# EAGLE design led driver schematic (EAGLE 9.6.0)

## Sheet 1 of 2
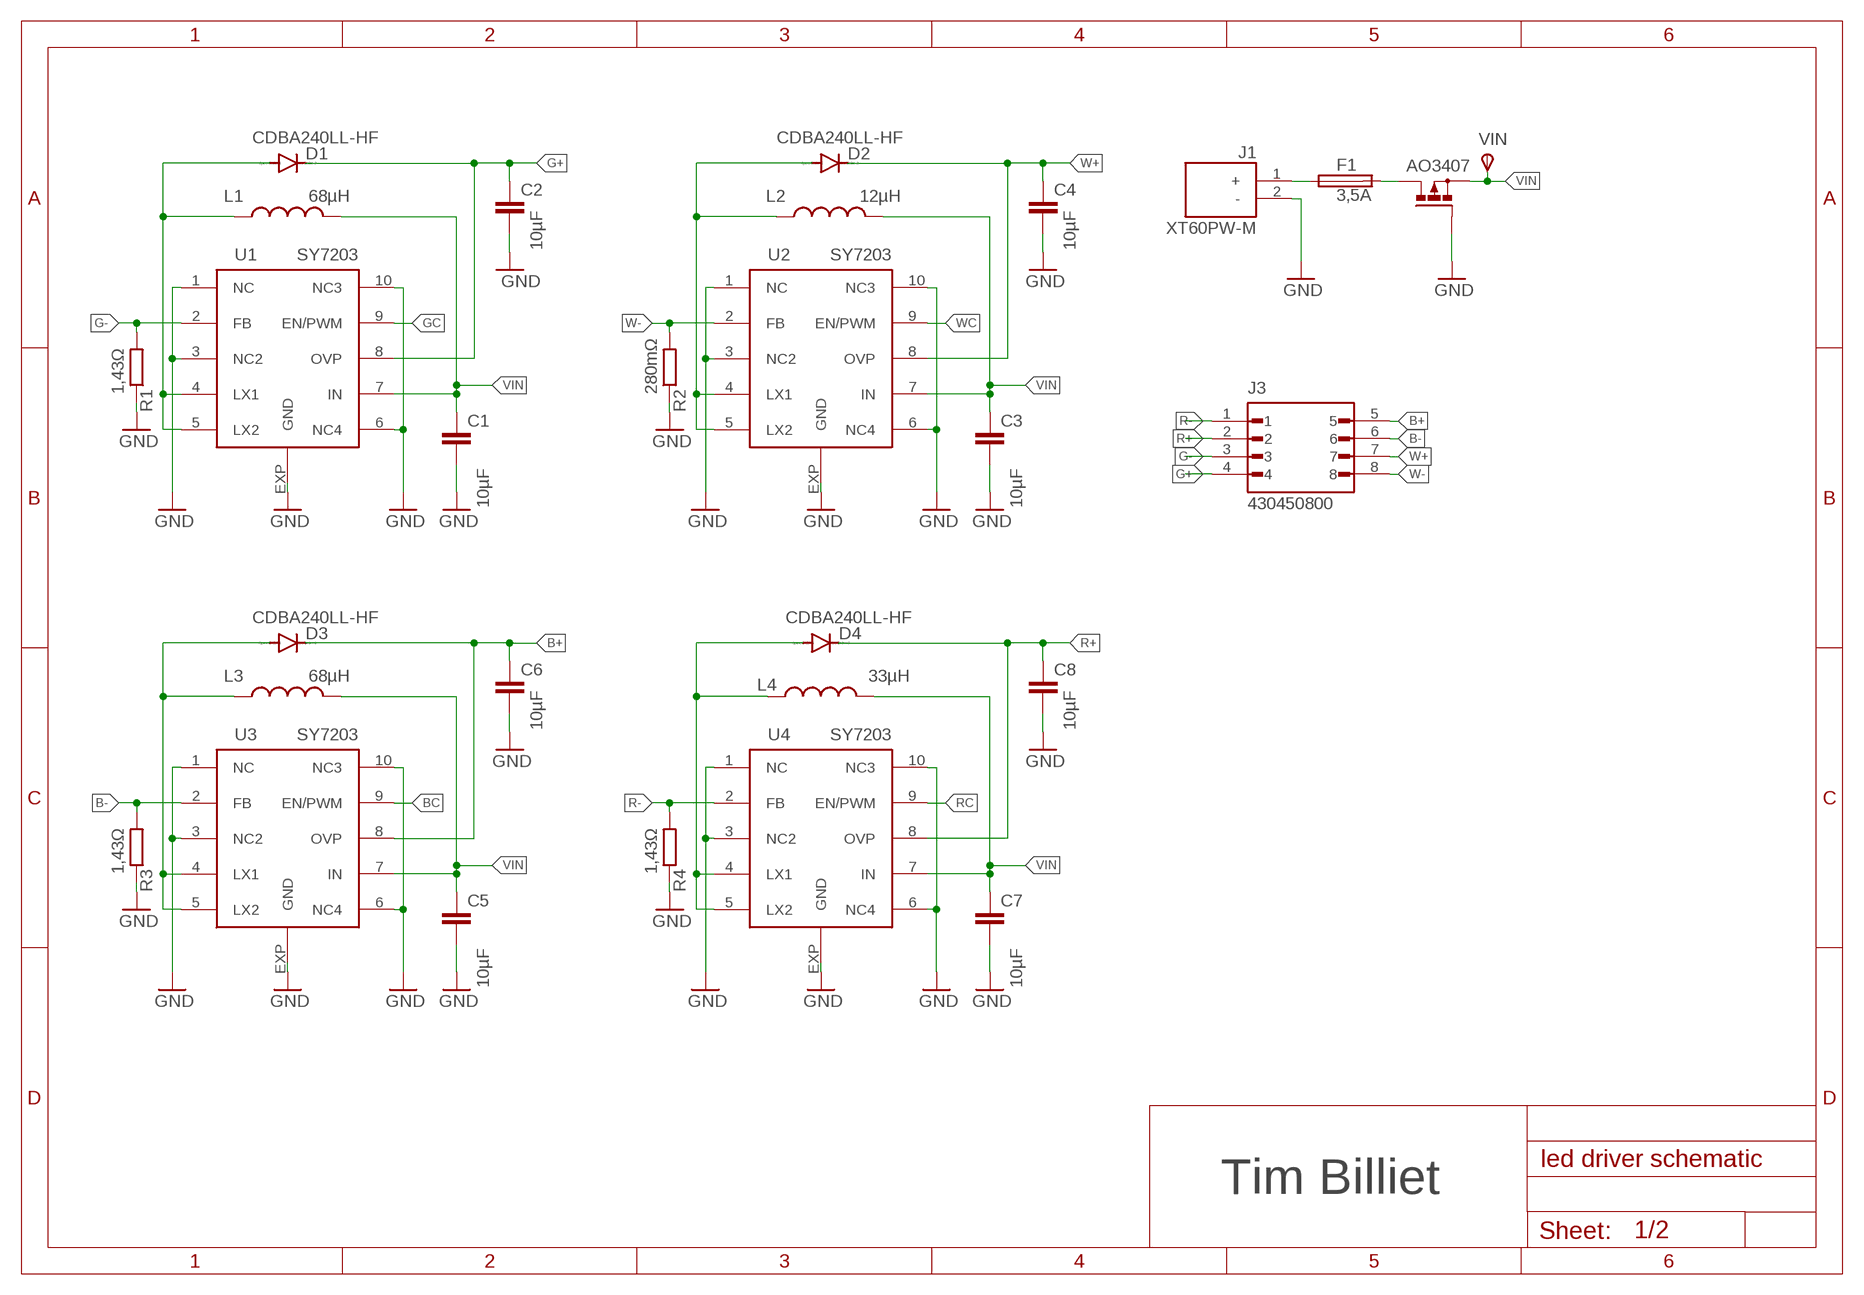
[diagram p0: schematic, sheet 1]

### Parts
C1  10µF  C-EUC0603  [C0603]
C2  10µF  C-EUC0603  [C0603]
C3  10µF  C-EUC0603  [C0603]
C4  10µF  C-EUC0603  [C0603]
C5  10µF  C-EUC0603  [C0603]
C6  10µF  C-EUC0603  [C0603]
C7  10µF  C-EUC0603  [C0603]
C8  10µF  C-EUC0603  [C0603]
D1  CDBA240LL-HF  DIODE-DO-214AC  [DO-214AC]
D2  CDBA240LL-HF  DIODE-DO-214AC  [DO-214AC]
D3  CDBA240LL-HF  DIODE-DO-214AC  [DO-214AC]
D4  CDBA240LL-HF  DIODE-DO-214AC  [DO-214AC]
F1  3,5A  0603FUSE0603  [R0603]
J1  XT60PW-M  [AMASS_XT60PW-M]
J3  430450800  [MOLEX_430450800]
L1  68µH  MBH125  [MBH125]
L2  12µH  MS127  [MS127-120MT]
L3  68µH  MBH125  [MBH125]
L4  33µH  MS127  [MS127-120MT]
Q1  AO3407  AO3407SOT23  [SOT23]
R1  1,43Ω  R-EU_R0805  [R0805]
R2  280mΩ  R-EU_R0805  [R0805]
R3  1,43Ω  R-EU_R0805  [R0805]
R4  1,43Ω  R-EU_R0805  [R0805]
U1  SY7203  SY7203DBC  [DFN10-3X3]
U2  SY7203  SY7203DBC  [DFN10-3X3]
U3  SY7203  SY7203DBC  [DFN10-3X3]
U4  SY7203  SY7203DBC  [DFN10-3X3]
VIN  TPSTP10R  [TP10R]

### Nets
B+: C6.1 D3.C J3.5 U3.8(OVP)
B-: J3.6 R3.2 U3.2(FB)
BC: U3.9(EN/PWM) ; also sheet 2
G+: C2.1 D1.C J3.4 U1.8(OVP)
G-: J3.3 R1.2 U1.2(FB)
GC: U1.9(EN/PWM) ; also sheet 2
GND: C1.2 C2.2 C3.2 C4.2 C5.2 C6.2 C7.2 C8.2 J1.2(-) Q1.1(G) R1.1 R2.1 R3.1 R4.1 U1.1(NC) U1.3(NC2) U1.6(NC4) U1.10(NC3) U1.EXP(GND) U2.1(NC) U2.3(NC2) U2.6(NC4) U2.10(NC3) U2.EXP(GND) U3.1(NC) U3.3(NC2) U3.6(NC4) U3.10(NC3) U3.EXP(GND) U4.1(NC) U4.3(NC2) U4.6(NC4) U4.10(NC3) U4.EXP(GND) ; also sheet 2
LX1: D1.A L1.P$1 U1.4(LX1) U1.5(LX2)
LX2: D2.A L2.P$1 U2.4(LX1) U2.5(LX2)
LX3: D3.A L3.P$1 U3.4(LX1) U3.5(LX2)
LX4: D4.A L4.P$1 U4.4(LX1) U4.5(LX2)
N$2: F1.1 J1.1(+)
N$27: F1.2 Q1.3(D)
R+: C8.1 D4.C J3.2 U4.8(OVP)
R-: J3.1 R4.2 U4.2(FB)
RC: U4.9(EN/PWM) ; also sheet 2
VIN: C1.1 C3.1 C5.1 C7.1 L1.P$2 L2.P$2 L3.P$2 L4.P$2 Q1.2(S) U1.7(IN) U2.7(IN) U3.7(IN) U4.7(IN) VIN.TP(PP) ; also sheet 2
W+: C4.1 D2.C J3.7 U2.8(OVP)
W-: J3.8 R2.2 U2.2(FB)
WC: U2.9(EN/PWM) ; also sheet 2

### Notes on the sheet
- Tim Billiet

## Sheet 2 of 2
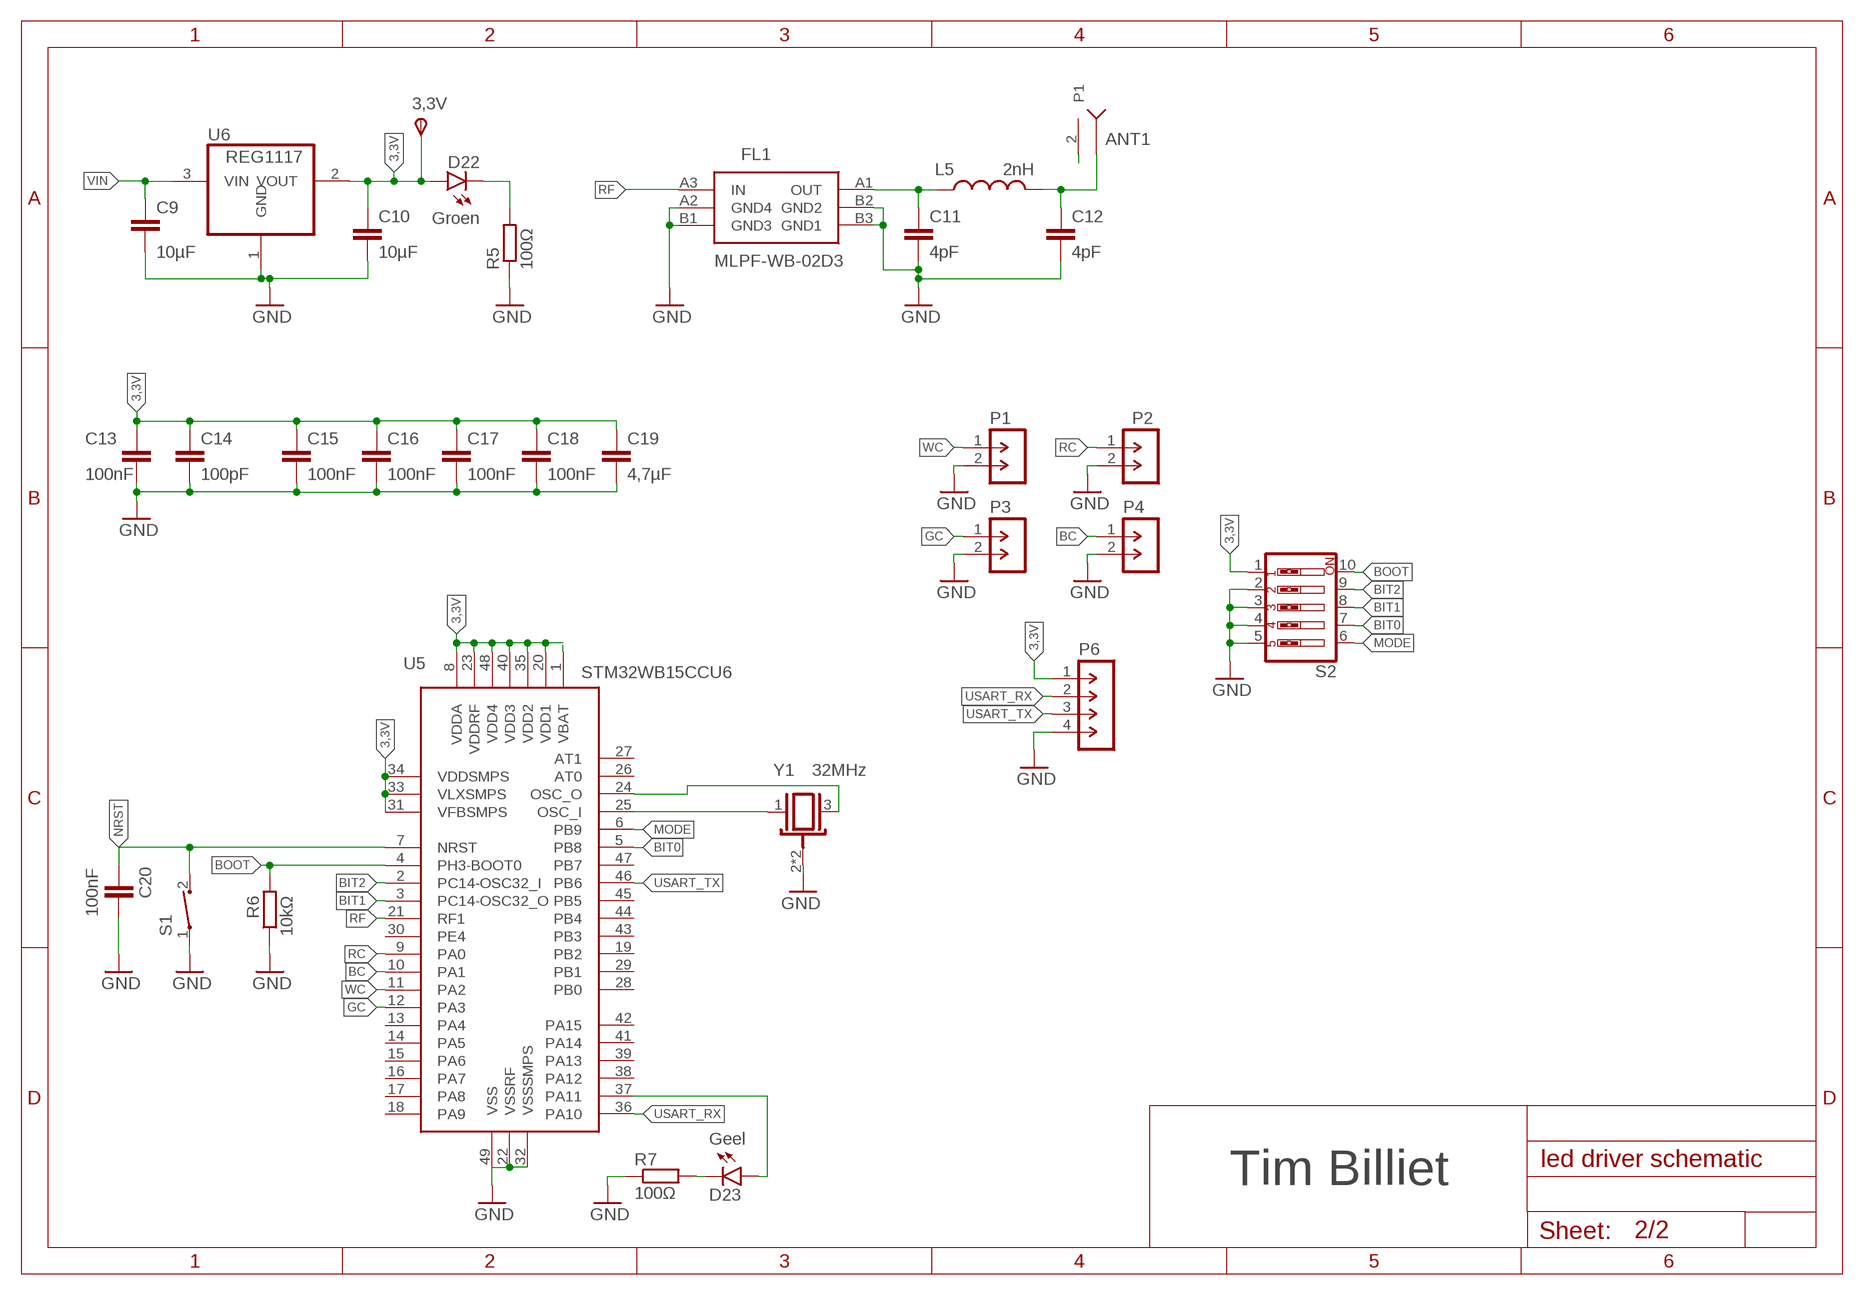
[diagram p1: schematic, sheet 2]

### Parts
3,3V  TPSTP10R  [TP10R]
ANT1  ANT3216LL00R2400A  [ANT3216LL00R2400A]
C9  10µF  C-EUC0603  [C0603]
C10  10µF  C-EUC0603  [C0603]
C11  4pF  C-EUC0603  [C0603]
C12  4pF  C-EUC0603  [C0603]
C13  100nF  C-EUC0603  [C0603]
C14  100pF  C-EUC0603  [C0603]
C15  100nF  C-EUC0603  [C0603]
C16  100nF  C-EUC0603  [C0603]
C17  100nF  C-EUC0603  [C0603]
C18  100nF  C-EUC0603  [C0603]
C19  4,7µF  C-EUC0603  [C0603]
C20  100nF  C-EUC0603  [C0603]
D22  Groen  LEDCHIP-LED0603  [CHIP-LED0603]
D23  Geel  LEDCHIP-LED0603  [CHIP-LED0603]
FL1  MLPF-WB-02D3  [MLPFWB02D3]
L5  2nH  0603INDUCTOR  [R0603]
P1  M-1X02-SIP-100-32  [SIP-100-02-32]
P2  M-1X02-SIP-100-32  [SIP-100-02-32]
P3  M-1X02-SIP-100-32  [SIP-100-02-32]
P4  M-1X02-SIP-100-32  [SIP-100-02-32]
P6  M-1X04-SIP-100-32  [SIP-100-04-32]
R5  100Ω  R-EU_R0603  [R0603]
R6  10kΩ  R-EU_R0603  [R0603]
R7  100Ω  R-EU_R0603  [R0603]
S1  TS-1088R-02026  [TS1088R02026]
S2  SW_DIP-5  [EDG-05]
U5  STM32WB15CCU6  [QFN50P700X700X60-49N]
U6  REG1117  [SOT223]
Y1  32MHz  NX2016SA  [OSC_NX2016SA]

### Nets
3,3V: 3,3V.TP(PP) C10.1 C13.1 C14.1 C15.1 C16.1 C17.1 C18.1 C19.1 D22.A P6.1 S2.1 U5.1(VBAT) U5.8(VDDA) U5.20(VDD1) U5.23(VDDRF) U5.31(VFBSMPS) U5.33(VLXSMPS) U5.34(VDDSMPS) U5.35(VDD2) U5.40(VDD3) U5.48(VDD4) U6.2(VOUT)
BC: P4.1 U5.10(PA1) ; also sheet 1
BIT0: S2.7 U5.5(PB8)
BIT1: S2.8 U5.3(PC14-OSC32_O)
BIT2: S2.9 U5.2(PC14-OSC32_I)
BOOT: R6.2 S2.10 U5.4(PH3-BOOT0)
GC: P3.1 U5.12(PA3) ; also sheet 1
GND: C9.2 C10.2 C11.2 C12.2 C13.2 C14.2 C15.2 C16.2 C17.2 C18.2 C19.2 C20.1 FL1.A2(GND4) FL1.B1(GND3) FL1.B2(GND2) FL1.B3(GND1) P1.2 P2.2 P3.2 P4.2 P6.4 R5.1 R6.1 R7.1 S1.1 S2.2 S2.3 S2.4 S2.5 U5.22(VSSRF) U5.32(VSSSMPS) U5.49(VSS) U6.1(GND) Y1.2(GND) Y1.4(GND) ; also sheet 1
MODE: S2.6 U5.6(PB9)
N$1: ANT1.1(ANTENNA) C12.1 L5.2
N$3: D23.A U5.37(PA11)
N$4: ANT1.2(P1)
N$11: C11.1 FL1.A1(OUT) L5.1
N$16: U5.25(OSC_I) Y1.1
N$17: U5.24(OSC_O) Y1.3
N$20: D22.C R5.2
N$23: D23.C R7.2
NRST: C20.2 S1.2 U5.7(NRST)
RC: P2.1 U5.9(PA0) ; also sheet 1
RF: FL1.A3(IN) U5.21(RF1)
USART_RX: P6.2 U5.36(PA10)
USART_TX: P6.3 U5.46(PB6)
VIN: C9.1 U6.3(VIN) ; also sheet 1
WC: P1.1 U5.11(PA2) ; also sheet 1
Unconnected: U5.13(PA4) U5.14(PA5) U5.15(PA6) U5.16(PA7) U5.17(PA8) U5.18(PA9) U5.19(PB2) U5.26(AT0) U5.27(AT1) U5.28(PB0) U5.29(PB1) U5.30(PE4) U5.38(PA12) U5.39(PA13) U5.41(PA14) U5.42(PA15) U5.43(PB3) U5.44(PB4) U5.45(PB5) U5.47(PB7)

### Notes on the sheet
- Tim Billiet

## Library data of the parts
3,3V VIN = testpad:TPS: TEST PIN
ANT1 = mijn-library:ANT3216LL00R2400A: Ceramic Chip Antenna ANT3216LL00R2400A 2.4 - 2.5 GHZ FEATURES z Compact size z Omni-directional radiation z Tape & reel automatic mounting z Reflow process compatible z RoHS compliant APPLICATIONS z 2.4 GHz WiFi device z Bluetooth gadget z Zigbee device z ISM band equipment
C1-C20 = rcl:C-EU: CAPACITOR, European symbol; SPICEPREFIX: C
D1-D4 = diode:DIODE-: DIODE
D22 D23 = led:LED: LED OSRAM: - CHIPLED LG R971, LG N971, LY N971, LG Q971, LY Q971, LO R971, LY R971 LH N974, LH R974 LS Q976, LO Q976, LY Q976 LO Q996 - Hyper CHIPLED LW Q18S LB Q993, LB Q99A, LB R99A - SideLED LS A670, LO A670, LY A670, LG A670, LP A670 LB A673, LV A673, LT A673, LW A673 LH A674 LY A675 LS A676, LA A676, LO A676, LY A676, LW A676 LS A679, LY A679, LG A679 - Hyper Micro SIDELED® LS Y876, LA Y876, LO Y876, LY Y876 LT Y87S - SmartLED LW L88C, LW L88S LB L89C, LB L89S, LG L890 LS L89K, LO L89K, LY L89K LS L896, LA L896, LO L896, LY L896 - TOPLED LS T670, LO T670, LY T670, LG T670, LP T670 LSG T670, LSP T670, LSY T670, LOP T670, LYG T670 LG T671, LOG T671, LSG T671 LB T673, LV T673, LT T673, LW T673 LH T674 LS T676, LA T676, LO T676, LY T676, LB T676, LH T676, LSB T676, LW T676 LB T67C, LV T67C, LT T67C, LS T67K, LO T67K, LY T67K, LW E67C LS E67B, LA E67B, LO E67B, LY E67B, LB E67C, LV E67C, LT E67C LW T67C LS T679, LY T679, LG T679 LS T770, LO T770, LY T770, LG T770, LP T770 LB T773, LV T773, LT T773, LW T773 LH T774 LS E675, LA E675, LY E675, LS T675 LS T776, LA T776, LO T776, LY T776, LB T776 LHGB T686 LT T68C, LB T68C - Hyper Mini TOPLED® LB M676 - Mini TOPLED Santana® LG M470 LS M47K, LO M47K, LY M47K Source: http://www.osram.convergy.de LUXEON: - LUMILED® LXK2-PW12-R00, LXK2-PW12-S00, LXK2-PW14-U00, LXK2-PW14-V00 LXK2-PM12-R00, LXK2-PM12-S00, LXK2-PM14-U00 LXK2-PE12-Q00, LXK2-PE12-R00, LXK2-PE12-S00, LXK2-PE14-T00, LXK2-PE14-U00 LXK2-PB12-K00, LXK2-PB12-L00, LXK2-PB12-M00, LXK2-PB14-N00, LXK2-PB14-P00, LXK2-PB14-Q00 LXK2-PR12-L00, LXK2-PR12-M00, LXK2-PR14-Q00, LXK2-PR14-R00 LXK2-PD12-Q00, LXK2-PD12-R00, LXK2-PD12-S00 LXK2-PH12-R00, LXK2-PH12-S00 LXK2-PL12-P00, LXK2-PL12-Q00, LXK2-PL12-R00 Source: www.luxeon.com KINGBRIGHT: KA-3528ASYC Source: www.kingbright.com
F1 = mijn-library:0603FUSE
FL1 = SamacSys_Parts:MLPF-WB-02D3: 2.4 GHz Low Pass Filter matched to STM32WB5x and STM32WB1x in WLCSP and UFBGA packages Source: Datasheet <https://www.st.com/resource/en/datasheet/mlpf-wb-02d3.pdf>; DESCRIPTION: 2.4 GHz Low Pass Filter matched to STM32WB5x and STM32WB1x in WLCSP and UFBGA packages; HEIGHT: 0.68mm; MANUFACTURER_NAME: STMicroelectronics; MANUFACTURER_PART_NUMBER: MLPF-WB-02D3; MOUSER_PART_NUMBER: 511-MLPF-WB-02D3; MOUSER_PRICE-STOCK: https://www.mouser.co.uk/ProductDetail/STMicroelectronics/MLPF-WB-02D3?qs=T%252BzbugeAwjhlflKeEN03Bg%3D%3D
J1 = XT60PW-M:XT60PW-M: Check availability <https://pricing.snapeda.com/parts/XT60PW-M/AMASS/view-part?ref=eda>; AVAILABILITY: Not in stock; CHECK_PRICES: https://www.snapeda.com/parts/XT60PW-M/AMASS/view-part/?ref=eda; DESCRIPTION: Socket, DC supply, male, PIN: 2; MF: AMASS; MP: XT60PW-M; PACKAGE: Package; PRICE: None; SNAPEDA_LINK: https://www.snapeda.com/parts/XT60PW-M/AMASS/view-part/?ref=snap
J3 = 430450800:430450800: Check availability <https://pricing.snapeda.com/parts/43045-0800/Molex/view-part?ref=eda>; AVAILABILITY: In Stock; CHECK_PRICES: https://www.snapeda.com/parts/43045-0800/Molex/view-part/?ref=eda; DESCRIPTION: Header 2 Row Right-Angle Snap-In Lock 8 Pin Tin Plate SMT/Glow Wire Compatible | Molex Incorporated 43045-0800; MF: Molex; MP: 43045-0800; PACKAGE: None; PRICE: None; PURCHASE-URL: https://www.snapeda.com/api/url_track_click_mouser/?unipart_id=313045&manufacturer=Molex&part_name=43045-0800&search_term=43045; SNAPEDA_LINK: https://www.snapeda.com/parts/43045-0800/Molex/view-part/?ref=snap
L1 L3 = mijn-library:MBH125
L2 L4 = mijn-library:MS127: ±20% SMD,12.2x12.2mm Power Inductors ROHS
L5 = mijn-library:0603INDUCTOR
P1-P4 = con-headers-jp:M-1X02-: MALE HEADER
P6 = con-headers-jp:M-1X04-: MALE HEADER
Q1 = mijn-library:AO3407
R1-R7 = rcl:R-EU_: RESISTOR, European symbol; SPICEPREFIX: R
S1 = SamacSys_Parts:TS-1088R-02026: SMD,3x4x2.0mm Tactile Switches Source: Datasheet <https://datasheet.lcsc.com/szlcsc/1912111437_XUNPU-TS-1088R-02026_C455280.pdf>; DESCRIPTION: SMD,3x4x2.0mm Tactile Switches; HEIGHT: 2.2mm; MANUFACTURER_NAME: XUNPU; MANUFACTURER_PART_NUMBER: TS-1088R-02026
S2 = special:SW_DIP-5: DIP SWITCH
U1-U4 = mijn-library:SY7203DBC: SY7203 develops a step-up DC/DC converter that delivers an accurate constant current for driving LEDs. Operating at a fixed switching frequency of 1MHz allows the device to be used with small value external ceramic capacitors and inductor. The LED current is programmable through the external resistor. The device also supports PWM dimming for accurate LED current control. SY7203 is ideal for driving up to eight white LEDs in series or up to 30V.
U5 = mijn-library:STM32WB15CCU6
U6 = burr-brown:REG1117: 800mA and 1A Low Dropout (LDO) Positive Regulator 1.8V, 2.5V, 2.85V, 3.3V, 5V, and Adj; MPN: REG1117
Y1 = NX2016SA-24MHZ-EXS00A-CS10820:NX2016SA: Crystal 6pF 80 Ohms 4-SMD, No Lead; AVAILABILITY: Not in stock; CHECK_PRICES: https://www.snapeda.com/parts/NX2016SA-24MHZ-EXS00A-CS10820/NDK+America%252C+Inc./view-part/?ref=eda; DESCRIPTION: 24 MHz ±15ppm Crystal 8pF 80 Ohms 4-SMD, No Lead; MF: NDK America, Inc.; MP: NX2016SA-24MHZ-EXS00A-CS10820; PACKAGE: SMD-4 NDK America,; PRICE: None; SNAPEDA_LINK: https://www.snapeda.com/parts/NX2016SA-24MHZ-EXS00A-CS10820/NDK+America%252C+Inc./view-part/?ref=snap

## Board
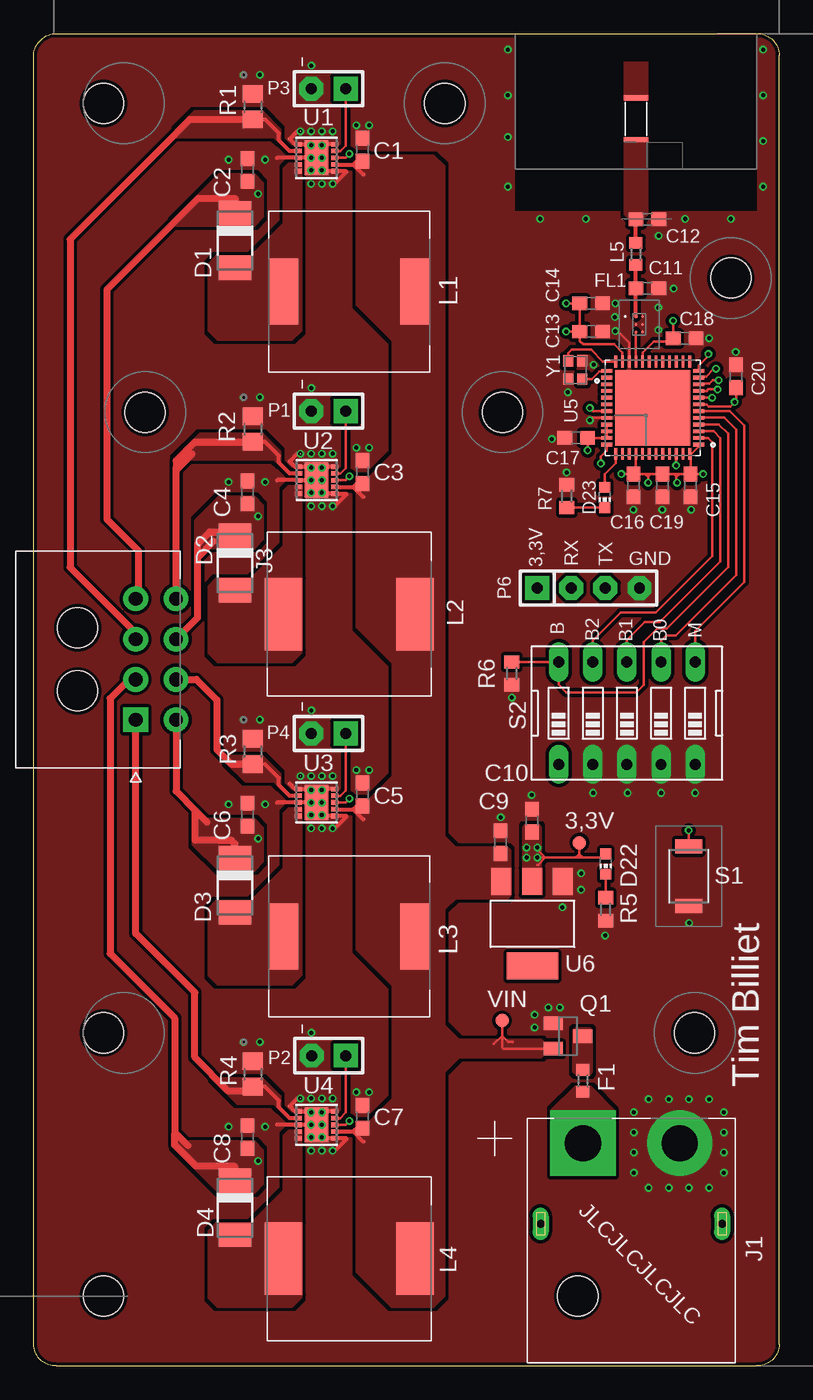
[diagram p2: board, top side]
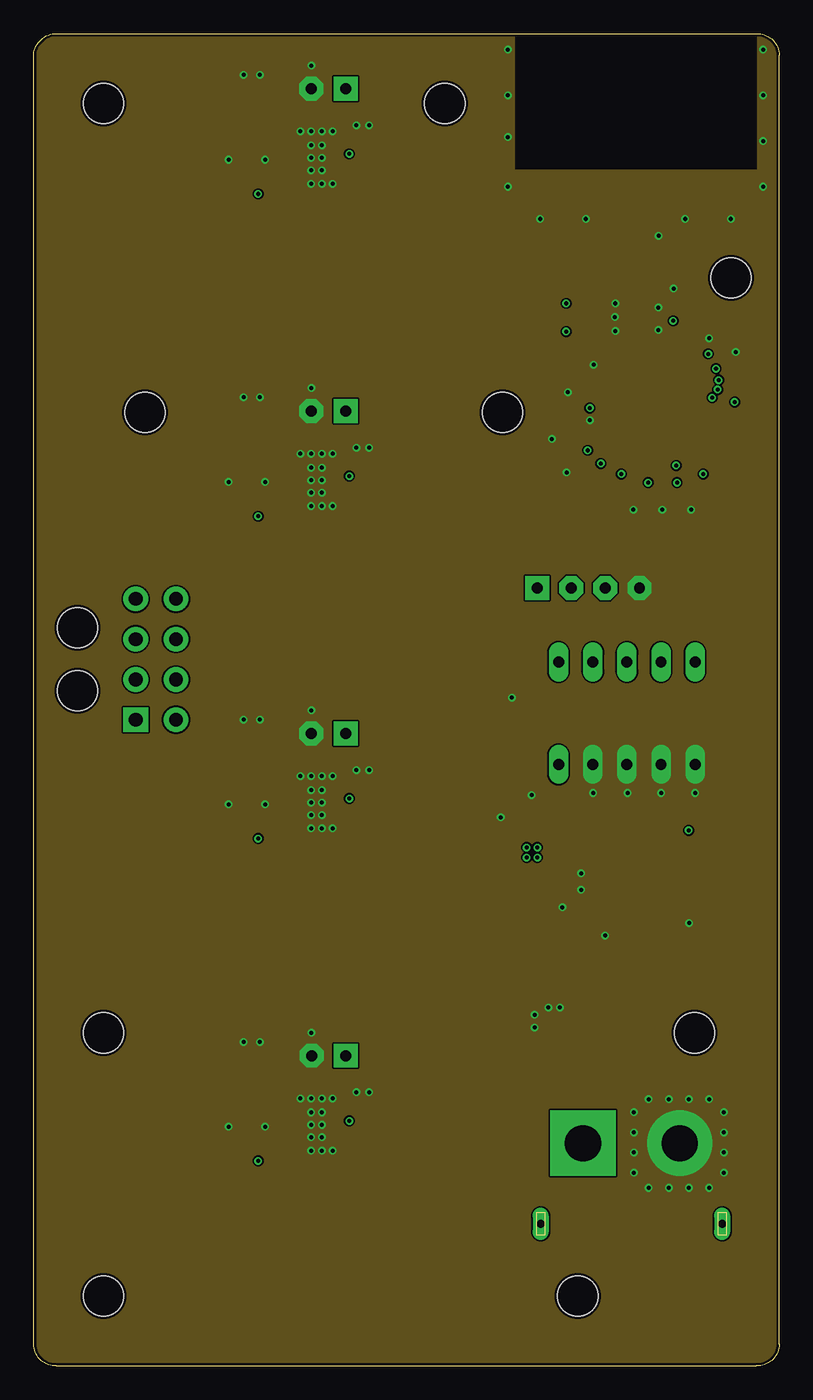
[diagram p3: board, inner layer Route2]
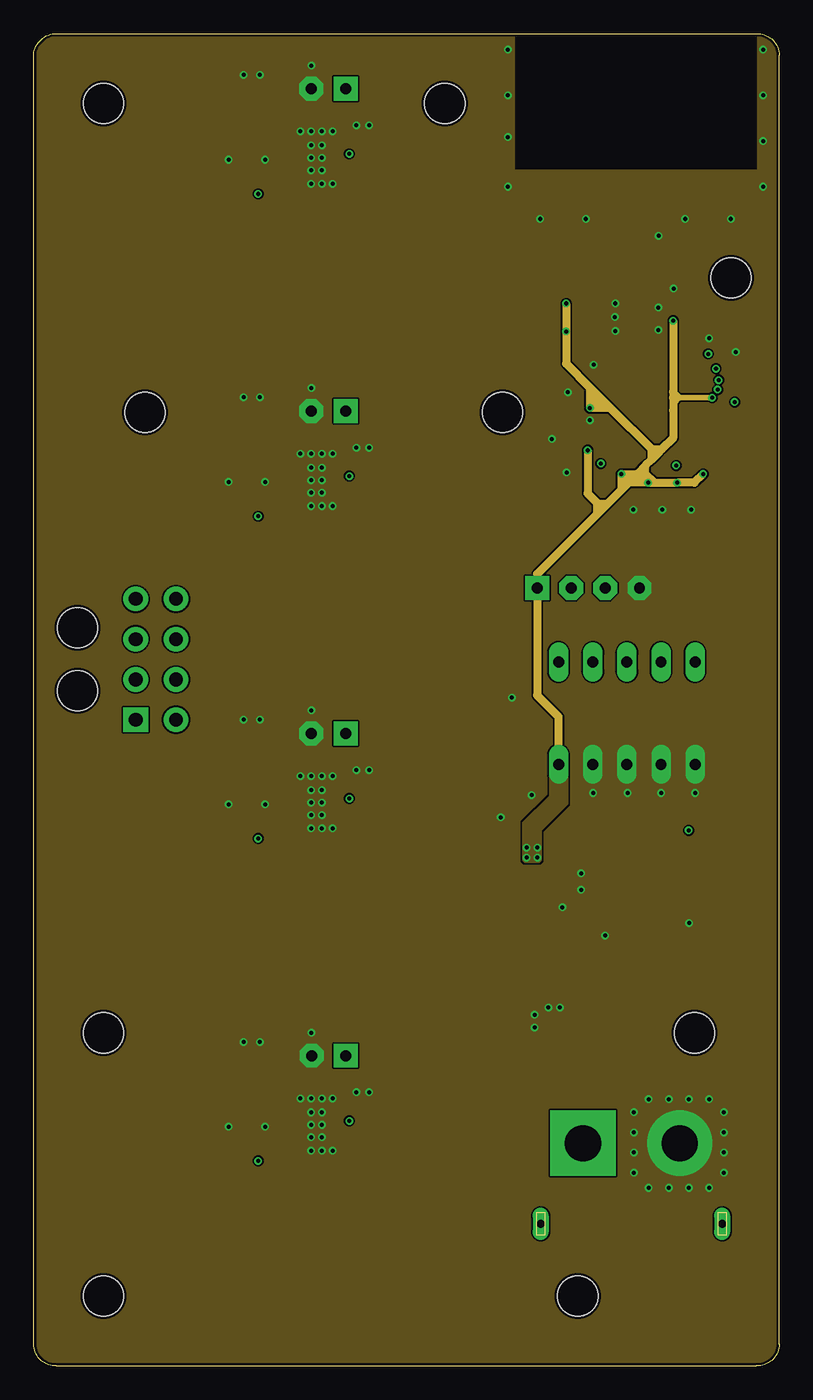
[diagram p4: board, inner layer Route15]
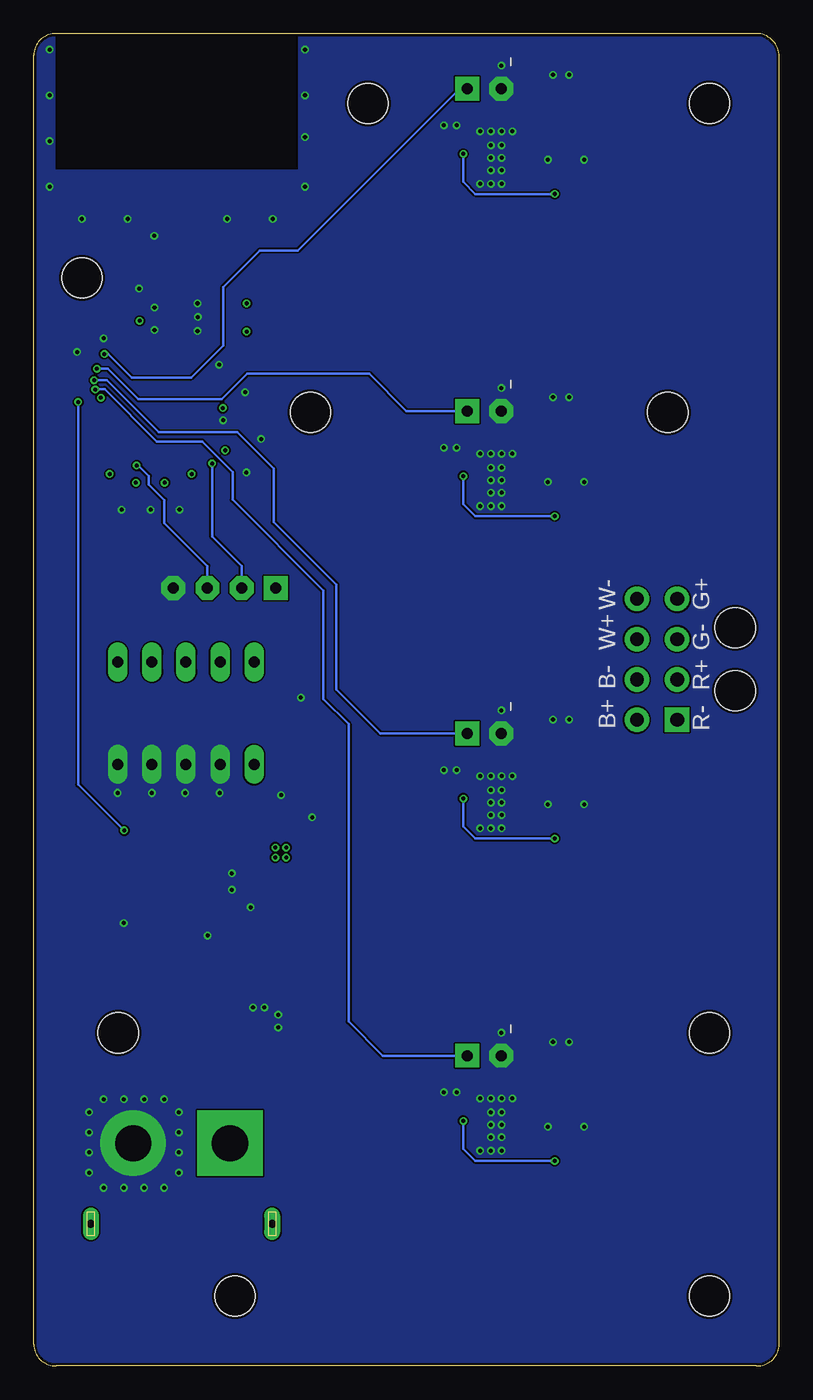
[diagram p5: board, bottom side, seen from below]

Size 55.5 x 99.2 mm. Coordinates in mm from the lower left corner, seen from the top.
Outline: 53.8,99.2 arc-90 55.5,97.6 55.5,1.6 arc-90 53.8,0 1.7,0 arc-90 0,1.6 0,97.5 arc-90 1.7,99.2 53.8,99.2
Copper layers (1+2*15+16): Top 0.035mm / dielectric 0.2mm / Route2 0.0175mm / dielectric 1.065mm / Route15 0.0175mm / dielectric 0.2mm / Bottom 0.035mm
Design rules "jlcpcb-4layers *": minimum track width 3.5mil, minimum drill 0.2mm, track to track 5mil, track to pad 0.2mm, pad to pad 5mil, via to via 5mil, smd to smd 5mil, copper to edge 0.2mm, drill to drill 6mil, minimum pad ring 10mil, minimum via ring 0.13mm, stop-mask expansion 0.05mm, vias tented up to drill 16mil, thermal gap 10mil
Holes 3 mm at 40.5,5.2 5.2,5.2 5.2,24.8 49.2,24.8 8.3,71 34.9,71 5.2,94 30.6,94 51.9,81

### Footprints (pad centres in the part's own frame; a part is rotated, then mirrored left to right if it is on the bottom)
TP10R = smd 1 x 1: TP 0,0
ANT3216LL00R2400A = smd 0.4 x 1.8: 1 1.55,0; 2 -1.55,0
C0603 = smd 1.1 x 1: 1 -0.85,0; 2 0.85,0
DO-214AC = smd 1.8 x 2.4: A 2.025,0; C -2.025,0
CHIP-LED0603 = smd 0.8 x 0.8: A 0,-0.75; C 0,0.75
R0603 = smd 0.87 x 0.98: 1 -0.815,0; 2 0.815,0
MLPFWB02D3 = smd 0.22 x 0.22: A1 -0.25,0.577; A2 -0.25,0; A3 -0.25,-0.577; B1 0.25,0.577; B2 0.25,0; B3 0.25,-0.577
AMASS_XT60PW-M = drill 2.7 square: 1 3.6,-6 | drill 2.7: 2 -3.6,-6 | drill 0.6 pad 1.2 long: S1 6.75,0; S2 -6.75,0
MOLEX_430450800 = drill 1.02 pad 1.52 square: 1 0,0 | drill 1.02 pad 1.52: 2 -3,0; 3 -6,0; 4 -9,0; 5 0,3; 6 -3,3; 7 -6,3; 8 -9,3 | hole 3: -2.15,-4.32; -6.85,-4.32
MBH125 = smd 4.9 x 2.2: P$1 0,4.9; P$2 0,-4.9
MS127-120MT = smd 5.4 x 2.8: P$1 0,-4.9; P$2 0,4.9
SIP-100-02-32 = drill 0.813 pad 1.778 square: 1 -1.27,0 | drill 0.813 pad 1.778 octagon: 2 1.27,0
SIP-100-04-32 = drill 0.813 pad 1.778 square: 1 -3.81,0 | drill 0.813 pad 1.778 octagon: 2 -1.27,0; 3 1.27,0; 4 3.81,0
SOT23 = smd 1 x 1.4: 1 -0.95,-1.1; 2 0.95,-1.1; 3 0,1.1
R0805 = smd 1.3 x 1.5: 1 -0.95,0; 2 0.95,0
R0603' = smd 1 x 1.1: 1 -0.85,0; 2 0.85,0
TS1088R02026 = smd 1.05 x 2: 1 -2.225,0; 2 2.225,0
EDG-05 = drill 0.813 long: 1 -5.08,-3.81; 2 -2.54,-3.81; 3 0,-3.81; 4 2.54,-3.81; 5 5.08,-3.81; 6 5.08,3.81; 7 2.54,3.81; 8 0,3.81; 9 -2.54,3.81; 10 -5.08,3.81
DFN10-3X3 = smd 0.3 x 0.55: 1 -1,-1.35; 2 -0.5,-1.35; 3 0,-1.35; 4 0.5,-1.35; 5 1,-1.35; 6 1,1.35; 7 0.5,1.35; 8 0,1.35; 9 -0.5,1.35; 10 -1,1.35 | smd 2.6 x 1.75: EXP 0,0
QFN50P700X700X60-49N = smd 0.87 x 0.27: 1 -3.43,2.75; 2 -3.43,2.25; 3 -3.43,1.75; 4 -3.43,1.25; 5 -3.43,0.75; 6 -3.43,0.25; 7 -3.43,-0.25; 8 -3.43,-0.75; 9 -3.43,-1.25; 10 -3.43,-1.75; 11 -3.43,-2.25; 12 -3.43,-2.75; 25 3.43,-2.75; 26 3.43,-2.25; 27 3.43,-1.75; 28 3.43,-1.25; 29 3.43,-0.75; 30 3.43,-0.25; 31 3.43,0.25; 32 3.43,0.75; 33 3.43,1.25; 34 3.43,1.75; 35 3.43,2.25; 36 3.43,2.75 | smd 0.27 x 0.87: 13 -2.75,-3.43; 14 -2.25,-3.43; 15 -1.75,-3.43; 16 -1.25,-3.43; 17 -0.75,-3.43; 18 -0.25,-3.43; 19 0.25,-3.43; 20 0.75,-3.43; 21 1.25,-3.43; 22 1.75,-3.43; 23 2.25,-3.43; 24 2.75,-3.43; 37 2.75,3.43; 38 2.25,3.43; 39 1.75,3.43; 40 1.25,3.43; 41 0.75,3.43; 42 0.25,3.43; 43 -0.25,3.43; 44 -0.75,3.43; 45 -1.25,3.43; 46 -1.75,3.43; 47 -2.25,3.43; 48 -2.75,3.43 | smd 5.6 x 5.6: 49 0,0
SOT223 = smd 1.499 x 2.007: 1 -2.261,-3.15; 2 0.025,-3.15; 3 2.311,-3.15 | smd 3.81 x 2.007: 4 0,3.15
OSC_NX2016SA = smd 0.75 x 0.85: 1 -0.525,0.675; 2 -0.525,-0.675; 3 0.525,-0.675; 4 0.525,0.675

### Placement (x,y rotation side)
3,3V  40.62,38.94 0 top
ANT1  44.83,92.85 270 top
C1  24.48,90.55 90 top
C2  15.92,89.04 90 top
C3  24.48,66.55 90 top
C4  15.92,65.04 90 top
C5  24.48,42.55 90 top
C6  15.92,41.04 90 top
C7  24.48,18.55 90 top
C8  15.92,17.04 90 top
C9  34.76,39 90 top
C10  37.11,40.6 90 top
C11  45.68,80.22 0 top
C12  45.68,85.37 0 top
C13  41.49,77.01 0 top
C14  41.49,79.11 0 top
C15  48.9,65.56 270 top
C16  44.65,65.56 270 top
C17  40.38,69.1 180 top
C18  48.45,76.5 0 top
C19  46.8,65.56 270 top
C20  52.28,73.69 270 top
D1  14.99,83.78 270 top
D2  14.99,59.78 270 top
D3  14.99,35.78 270 top
D4  14.99,11.78 270 top
D22  42.58,37.37 180 top
D23  42.51,64.66 180 top
F1  40.88,21.23 90 top
FL1  45.08,77.56 0 top
J1  44.49,10.58 180 top
J3  7.6,48.11 270 top
L1  23.5,79.98 90 top
L2  23.5,55.98 270 top
L3  23.5,31.98 90 top
L4  23.5,7.98 270 top
L5  44.83,82.79 90 top
P1  21.95,71.1 180 top
P2  21.96,23.1 180 top
P3  21.95,95.1 180 top
P4  21.95,47.1 180 top
P6  41.29,57.93 0 top
Q1  39.77,24.56 270 top
R1  16.32,93.74 270 top
R2  16.32,69.74 270 top
R3  16.31,45.74 270 top
R4  16.32,21.74 270 top
R5  100Ω  [R0603']  42.58,34 90 top
R6  10kΩ  [R0603']  35.59,51.56 90 top
R7  100Ω  [R0603']  39.68,64.76 270 top
S1  48.76,36.46 90 top
S2  44.16,48.6 0 top
U1  21.06,89.95 270 top
U2  21.07,65.95 270 top
U3  21.06,41.95 270 top
U4  21.06,17.95 270 top
U5  46.08,71.34 180 top
U6  37.13,32.92 180 top
VIN  34.87,25.71 0 top
Y1  40.32,74.15 180 top

### Tracks (layer width: path | path; a pad name or v marks a point on that pad's centre or on a via)
3,3V  (via drill 0.3)
  Top 0.203: C13.1 C14.1 | C14.1 | C13.1 40.65,76.31 40.9,76.06 43.2,76.06 43.83,75.43 U5.23 | C17.1 U5.35 U5.34 U5.33 | C17.1 | U5.40 44.83,66.59 C16.1 | C16.1 45.54,66.41 | 45.54,66.41 45.75,66.41 | 45.75,66.41 45.95,66.41 | 45.95,66.41 C19.1 47.65,66.41 | U5.48 48.9,67.84 | 48.9,67.84 C15.1 | C15.1 48.05,66.41 | 48.05,66.41 47.85,66.41 | 47.85,66.41 47.65,66.41 | U5.20 45.33,75.44 46.14,76.25 47.38,76.25 C18.1 v47.6,77.81 | v39.64,77.01 C13.1 | v39.64,79.11 C14.1 | v41.24,68.17 C17.1 | v43.74,66.41 C16.1 | v47.89,65.76 47.85,65.8 47.85,66.21 | 47.85,66.41 47.85,66.21 | 47.65,66.41 47.85,66.21 | 47.85,66.21 48.05,66.41 | v45.74,65.76 45.74,66.21 | 45.74,66.21 45.74,66.4 45.75,66.41 | 45.95,66.41 45.75,66.21 45.74,66.21 | 45.54,66.41 45.74,66.21 | v49.84,66.41 C15.1 | C10.1 37.11,39.71 | v50.5,72.08 U5.8 | U5.31 41.63,71.1 v41.41,71.32 | U5.1 49.51,68.45 48.9,67.84 | D22.A 42.31,37.85 40.87,37.85 | 40.87,37.85 40.61,37.85 | 40.61,37.85 40.37,37.85 | 40.37,37.85 38.09,37.85 | v37.5,37.85 38.09,37.85 | 40.61,37.85 40.62,37.86 40.62,38.1 | 3,3V.TP 40.62,38.1 | 40.37,37.85 40.62,38.1 | 40.62,38.1 40.87,37.85 | 38.09,37.85 37.5,38.44 v37.5,38.6 | 38.09,37.85 37.55,37.31 37.49,37.31
  Route15 0.41: 47.6,72.07 47.61,72.08 48.06,72.08 | v50.5,72.08 48.06,72.08 | 47.6,72.54 48.06,72.08 | 48.06,72.08 47.6,71.62 47.6,71.14
  Route15 0.6: S2.1 39.08,48.33 37.48,49.93 P6.1 37.48,58.96 41.95,63.43 | v49.84,66.41 49.19,65.76 v47.89,65.76 46.19,65.76 | v45.74,65.76 46.19,65.76 | 46.77,68.25 47.6,69.08 47.6,71.14 47.6,72.07 47.6,72.54 v47.6,77.81 | 46.77,68.25 46.38,67.86 | 46.38,67.86 46,67.48 | 46,67.48 45.54,67.02 | 45.54,67.02 45.01,66.49 | 44.93,66.41 44.7,66.18 | 44.7,66.18 44.34,65.81 | 44.34,65.81 43.74,65.22 | 43.74,65.22 42.74,64.22 | 42.74,64.22 42.36,63.84 | 42.36,63.84 41.95,63.43 | v45.74,65.76 45.32,66.18 | 45.32,66.18 45.01,66.49 | 46.19,65.76 45.54,66.41 45.54,67.02 | 45.32,66.18 44.7,66.18 | 44.34,65.81 v43.74,66.41 | v43.74,66.41 43.74,65.7 | 43.74,65.7 43.74,65.22 | v43.74,66.41 44.93,66.41 | 44.93,66.41 45.01,66.49 | v45.74,65.76 43.8,65.76 43.74,65.7 | v39.64,79.11 v39.64,77.01 39.64,74.61 41.41,72.84 | 41.41,72.84 41.41,72.01 | 42.93,71.32 46,68.25 | 46,68.25 46.38,67.86 | 41.41,72.01 42.1,71.32 | 42.93,71.32 42.1,71.32 | 42.1,71.32 v41.41,71.32 41.41,72.01 | 41.41,72.84 42.93,71.32 | v41.24,68.17 41.24,64.96 41.95,64.25 | 41.95,64.25 41.99,64.21 | 41.99,64.21 42.36,63.84 | 41.95,63.43 41.95,64.25 | 41.99,64.21 42.01,64.22 42.74,64.22 | 46,67.48 46,68.25 | 46,68.25 46.77,68.25
  other vias: 36.7,37.85 36.7,38.6
  pour Top (no thermals): 36.41,36.93 36.41,40.11 36.56,40.26 37.65,40.26 37.8,40.11 37.8,36.93
  pour Route15 (no thermals): 36.41,40.42 36.41,37.68 36.59,37.5 37.61,37.5 37.79,37.68 37.79,39.92 39.76,41.89 39.76,45.07 39.41,45.42 38.75,45.42 38.4,45.07 38.4,42.41
B+  (via drill 0.3)
  Top 0.203: v23.51,42.24 23.22,41.95 U3.8
  Top 0.508: 14.42,37.8 D3.C 14.99,38.88 14.73,39.14 12.03,39.14 12.02,39.15 12.02,41.35 12.05,41.35 | 12.05,41.35 12.7,40.7 12.9,40.5 | J3.5 10.6,42.8 12.05,41.35
  Bottom 0.203: v23.51,42.24 23.51,40.16 22.61,39.26 v16.71,39.26
  pour Top (no thermals): 16.41,36.86 13.8,36.86 11.81,38.84 11.81,40.76 16.41,40.76 17.11,40.06 17.11,37.56
B-
  Top 0.3: U3.2 19.06,42.45 18.25,43.26 18.25,43.77 17.23,44.79
  Top 0.508: R3.2 14.74,44.79 13.64,45.89 13.64,49.59 12.12,51.11 J3.6
  pour Top (no thermals): 17.01,45.46 17.01,43.86 16.61,43.46 15.78,43.46 14.3,44.94 14.3,45.46
  pour Top (no thermals): 18.31,43.06 17.91,43.46 16.51,43.46 16.51,44.96 17.01,45.46 18.41,44.06 18.41,43.06
BC  (via drill 0.3)
  Top 0.203: P4.1 23.23,42.86 22.82,42.45 U3.9 | U5.10 49.57,73.15 50.3,73.15 50.54,73.39 v50.99,73.39
  Bottom 0.203: v50.99,73.39 50.07,73.39 46.2,69.52 40.33,69.52 37.63,66.82 37.63,62.82 32.97,58.16 32.97,50.38 29.69,47.1 P4.1
BIT0
  Top 0.203: U5.5 51.41,70.59 52.3,69.7 52.3,58.9 47.8,54.4 47.1,54.4 46.7,54 S2.7
BIT1
  Top 0.203: S2.8 44.16,54.06 45.5,55.4 46.6,55.4 51.1,59.9 51.1,69.1 50.61,69.59 U5.3
BIT2
  Top 0.203: S2.9 41.62,54.02 43.7,56.1 46.3,56.1 50.5,60.3 50.5,68.8 50.2,69.1 U5.2
BOOT
  Top 0.203: R6.2 S2.10 39.08,50.72 39.65,50.15 44.85,50.15 45.4,50.7 45.4,53.9 46.4,54.9 47.13,54.9 51.7,59.47 51.7,69.4 51.01,70.09 U5.4
G+  (via drill 0.3)
  Top 0.203: v23.51,90.24 23.22,89.95 U1.8
  Top 0.508: D1.C 15,86.94 12.27,86.94 5.46,80.13 5.46,63.04 7.8,60.7 7.8,57.31 J3.4
  Bottom 0.203: v23.51,90.24 23.51,88.16 22.61,87.26 v16.71,87.26
  pour Top (no thermals): 16.41,84.86 10.27,84.86 10.27,85.22 13.8,88.76 16.41,88.76 17.11,88.06 17.11,85.56
G-
  Top 0.3: U1.2 19.06,90.45 18.25,91.26 18.25,91.77 17.23,92.79 R1.2
  Top 0.508: R1.2 11.62,92.79 2.71,83.88 2.71,59.46 7.6,54.57 J3.3
  pour Top (no thermals): 17.01,93.46 17.01,91.86 16.61,91.46 10.56,91.46 10.56,92.02 12,93.46
  pour Top (no thermals): 18.31,91.06 17.91,91.46 16.51,91.46 16.51,92.96 17.01,93.46 18.41,92.06 18.41,91.06
GC  (via drill 0.3)
  Top 0.203: P3.1 23.23,90.86 22.82,90.45 U1.9 | v50.23,75.35 50.23,75.2 49.51,74.48 U5.12
  Bottom 0.203: v50.23,75.35 49.95,75.35 48.2,73.6 43.77,73.6 41.39,75.98 41.39,80.31 38.65,83.05 35.85,83.05 23.8,95.1 P3.1
GND  (via drill 0.3)
  Top 0.203: C9.2 | 39.37,36.09 U6.1 39.41,36.05 | C10.2 | U5.22 44.33,76.18 43.29,77.22 | U5.32 41.59,70.59
  Top 0.3: U2.EXP 21.07,65.26 21.38,64.95 U2.6 23.25,64.95 23.3,64.9 22.42,64.02 22.34,64.02 | U2.EXP U2.3 18.12,65.95 | 20.95,66.95 U2.1 19.45,66.95 19.05,67.35 19.62,67.92 | 20.95,66.95 21.1,66.8 21.1,65.98 U2.EXP | U2.10 20.95,66.95 | U1.EXP 21.07,89.26 21.38,88.95 23.25,88.95 23.3,88.9 22.42,88.02 22.34,88.02 | U1.EXP 18.12,89.95 | 20.95,90.95 19.45,90.95 19.05,91.35 19.62,91.92 | 20.95,90.95 21.1,90.8 21.1,89.98 U1.EXP | U1.10 20.95,90.95 | U3.EXP 21.07,41.26 21.38,40.95 23.25,40.95 23.3,40.9 22.42,40.02 v22.26,40.02 | U3.EXP 18.12,41.95 | 20.95,42.95 19.45,42.95 19.05,43.35 | 20.95,42.95 21.1,42.8 21.1,41.98 U3.EXP | U3.10 20.95,42.95 | U4.EXP 21.07,17.26 21.38,16.95 23.25,16.95 23.3,16.9 22.42,16.02 22.34,16.02 | U4.EXP 18.12,17.95 | 20.95,18.95 19.45,18.95 19.05,19.35 19.62,19.92 | 20.95,18.95 21.1,18.8 21.1,17.98 U4.EXP | U4.10 20.95,18.95
  other vias: 14.52,65.81 17.23,65.81 15.64,72.12 16.84,72.12 24.02,68.37 24.97,68.37 20.68,72.81 51.37,17.39 51.37,14.39 51.37,15.89 51.37,18.89 47.28,19.86 50.28,19.86 48.78,19.86 45.78,19.86 37.29,25.19 37.29,26.14 39.17,26.69 38.32,26.69 44.64,63.75 46.79,63.75 48.94,63.75 38.57,69.01 43.3,77.06 43.3,79.11 50.28,76.52 34.77,40.85 37.07,42.5 40.75,35.45 40.75,36.67 42.54,32.05 14.52,89.81 17.23,89.81 15.64,96.12 16.84,96.12 24.02,92.37 24.97,92.37 20.68,96.81 14.52,41.81 17.23,41.81 19.86,43.92 20.66,43.92 21.46,43.92 22.26,43.92 21.46,40.02 20.66,40.02 15.64,48.12 16.84,48.12 24.02,44.37 24.97,44.37 20.68,48.81 14.52,17.81 17.23,17.81 15.64,24.12 16.84,24.12 24.02,20.37 24.97,20.37 20.68,24.81 41.69,74.55 39.76,72.49 41.4,70.42 52.26,75.5 48.79,32.98 39.67,66.52 35.6,49.76 43.27,78.1 46.5,77.13 46.5,78.81 46.52,84.14 54.3,87.8 47.64,80.22 49.24,42.66 46.7,42.66 44.22,42.66 41.65,42.66 47.28,13.26 50.28,13.26 48.78,13.26 45.78,13.26 44.68,17.39 44.68,14.39 44.68,15.89 44.68,18.89 54.3,94.6 54.3,98 54.3,91.2 35.3,98 35.3,94.6 35.3,91.5 35.3,87.8 37.7,85.4 41.1,85.4 48.5,85.4 51.9,85.4 39.35,34.15 21.46,42.88 20.66,42.88 21.46,41.02 20.66,41.02 21.46,41.95 20.66,41.95 22.26,16.02 19.86,19.92 20.66,19.92 21.46,19.92 22.26,19.92 21.46,16.02 20.66,16.02 21.46,18.88 20.66,18.88 21.46,17.02 20.66,17.02 21.46,17.95 20.66,17.95 22.26,88.02 19.86,91.92 20.66,91.92 21.46,91.92 22.26,91.92 21.46,88.02 20.66,88.02 21.46,90.88 20.66,90.88 21.46,89.02 20.66,89.02 21.46,89.95 20.66,89.95 22.26,64.02 19.86,67.92 20.66,67.92 21.46,67.92 22.26,67.92 21.46,64.02 20.66,64.02 21.46,66.88 20.66,66.88 21.46,65.02 20.66,65.02 21.46,65.95 20.66,65.95
  pour Route2 (no thermals): 0,99.2 55.5,99.2 55.5,0 0,0
  pour Top (isolate 0.254, rank 2, no thermals): 0,99.2 55.5,99.2 55.5,0 0,0
  pour Route15 (rank 2, no thermals): 0,99.2 55.5,99.2 55.5,0 0,0
  pour Bottom (no thermals): 0,99.2 55.5,99.2 55.5,0 0,0
  cutout Route2: 35.84,89.1 35.84,99.2 53.84,99.2 53.84,89.1
  cutout Route15: 35.84,89.1 35.84,99.2 53.84,99.2 53.84,89.1
  cutout Bottom: 35.84,89.1 35.84,99.2 53.84,99.2 53.84,89.1
  cutout Top: 35.84,86.03 43.79,86.03 43.79,98.21 45.86,98.21 45.86,86 53.84,86 53.84,99.2 35.84,99.2
LX1
  pour Top (no thermals): 19.95,89.55 19.95,77.1 19.23,76.38 13.7,76.38 12.99,77.09 12.99,82.04 13.6,82.65 16.19,82.65 18.59,85.05 18.59,89.14 19,89.55
LX2
  pour Top (no thermals): 19.95,65.55 19.95,53.1 19.23,52.38 13.7,52.38 12.99,53.09 12.99,58.04 13.6,58.65 16.19,58.65 18.59,61.05 18.59,65.14 19,65.55
LX3
  pour Top (no thermals): 19.95,41.55 19.95,29.1 19.23,28.38 13.7,28.38 12.99,29.09 12.99,34.04 13.6,34.65 16.19,34.65 18.59,37.05 18.59,41.14 19,41.55
LX4
  pour Top (no thermals): 19.95,17.55 19.95,5.1 19.23,4.38 13.7,4.38 12.99,5.09 12.99,10.04 13.6,10.65 16.19,10.65 18.59,13.05 18.59,17.14 19,17.55
MODE
  Top 0.203: S2.6 49.24,54.71 52.9,58.37 52.9,70 51.81,71.09 U5.6
N$1
  Top 0.314: L5.2 C12.1
  pour Top (no thermals): 43.93,91.1 43.93,85.72 44.28,85.37 45.38,85.37 45.73,85.72 45.73,91.1
N$2
  pour Top (no thermals): 41.47,20.8 40.3,20.8 38.51,19.01 38.51,18.72 43.27,18.72 43.27,19
N$3
  Top 0.203: U5.37 43.33,67.23 42.51,66.41 D23.A
N$4
  pour Top (no thermals): 43.93,94.6 43.93,97.1 45.73,97.1 45.73,94.6
N$11
  Top 0.314: FL1.A1 C11.1 L5.1
N$16
  Top 0.203: U5.25 42.59,74.03 42.11,74.03 41.56,73.47 Y1.1
N$17
  Top 0.203: U5.24 42.38,74.77 41.49,75.66 40.05,75.66 39.8,75.41 Y1.3
N$20
  Top 0.203: R5.2 D22.C
N$23
  Top 0.203: R7.2 D23.C
N$27
  pour Top (no thermals): 41.34,21.63 41.59,21.88 41.59,24.98 41.39,25.18 40.34,25.18 40.14,24.98 40.14,21.93 40.44,21.63
NRST  (via drill 0.3)
  Top 0.203: U5.7 50.09,71.59 50.24,71.44 51.85,71.44 v52.18,71.77 52.28,71.87 C20.2 | S1.2 v48.76,39.87
  Bottom 0.203: v48.76,39.87 52.18,43.29 v52.18,71.77
R+  (via drill 0.3)
  Top 0.203: v23.51,18.24 23.22,17.95 U4.8
  Top 0.508: D4.C 14.99,14.79 14.9,14.88 12.07,14.88 10.5,16.45 10.5,17.25 | 10.5,17.25 10.5,25.9 5.7,30.7 5.7,49.7 7,51 7.49,51 J3.2 | 10.5,17.25 10.65,17.25 11.5,16.4
  Bottom 0.203: v23.51,18.24 23.51,16.16 22.61,15.26 v16.71,15.26
  pour Top (no thermals): 16.41,12.86 13.81,12.86 10.37,16.3 10.37,16.76 16.41,16.76 17.11,16.06 17.11,13.56
R-
  Top 0.3: U4.2 19.06,18.45 18.25,19.26 18.25,19.77 17.23,20.79 R4.2
  Top 0.508: R4.2 15.99,20.46 14.5,20.46 12,22.96 12,27.8 7.6,32.2 J3.1
  pour Top (no thermals): 17.01,21.46 17.01,19.86 16.61,19.46 15.21,19.46 13.21,21.46
  pour Top (no thermals): 18.31,19.06 17.91,19.46 16.51,19.46 16.51,20.96 17.01,21.46 18.41,20.06 18.41,19.06
RC  (via drill 0.3)
  Top 0.203: P2.1 23.24,18.87 22.82,18.45 U4.9 | U5.9 50.1,72.59 50.23,72.72 50.72,72.72 50.74,72.7 v50.91,72.7
  Bottom 0.203: v50.91,72.7 50.74,72.7 50.71,72.73 50.22,72.73 46.32,68.83 42.95,68.83 40.68,66.56 40.68,64.49 33.93,57.74 33.93,49.65 32.06,47.78 32.06,25.65 29.51,23.1 P2.1
RF
  Top 0.2: FL1.A3 U5.21
USART_RX  (via drill 0.3)
  Top 0.203: U5.36 42.65,68.15 42.22,67.72 v42.22,67.19
  Bottom 0.203: v42.22,67.19 42.22,61.76 40.02,59.56 P6.2
USART_TX  (via drill 0.3)
  Top 0.203: v47.83,67.05 U5.46
  Bottom 0.203: v47.83,67.05 47.7,67.05 46.92,66.27 46.92,65.62 45.77,64.47 45.77,62.77 42.56,59.56 P6.3
VIN
  Top 0.203: 34.76,36.13 U6.3 | VIN.TP 34.87,24.59 | 34.87,24.59 34.87,23.73 34.99,23.61 Q1.2 | 34.25,23.97 34.87,24.59 | 34.87,24.59 35.34,24.12 35.66,24.12
  Top 0.3: U2.7 23.8,65.45 | 23.8,65.45 24.23,65.45 C3.1 | 23.8,65.45 24.55,64.7 | 23.8,65.45 24.17,65.82 | 23.8,89.45 24.23,89.45 C1.1 | 23.8,89.45 24.55,88.7 | 23.8,89.45 24.17,89.82 | 23.8,41.45 24.23,41.45 C5.1 | 23.8,41.45 24.55,40.7 | 23.8,41.45 24.17,41.82 | 23.8,17.45 24.23,17.45 C7.1 | 23.8,17.45 24.55,16.7 | 23.8,17.45 24.17,17.82 | U4.7 23.8,17.45 | U3.7 23.8,41.45 | U1.7 23.8,89.45
  pour Top (no thermals): 24.01,66.16 24.01,55.01 26.66,52.36 29.76,52.36 30.61,53.21 30.61,65.31 29.76,66.16
  pour Top (no thermals): 24.01,90.16 24.01,79.01 26.66,76.36 29.76,76.36 30.61,77.21 30.61,89.31 29.76,90.16
  pour Top (no thermals): 24.01,42.16 24.01,31.01 26.66,28.36 29.76,28.36 30.61,29.21 30.61,41.31 29.76,42.16
  pour Top (no thermals): 24.01,18.16 24.01,7.01 26.66,4.36 29.76,4.36 30.61,5.21 30.61,17.31 29.76,18.16
  pour Top: 30.61,16.15 30.61,89.31 30.12,89.31 26.7,85.89 26.7,16.15
  pour Top (no thermals): 39.32,24.06 38.02,24.06 37.78,24.3 31.65,24.3 30.61,25.34 30.61,21.88 31.65,22.92 37.75,22.92 37.99,23.16 39.32,23.16
  pour Top (no thermals): 35.52,35.04 35.26,34.78 31.38,34.78 30.61,34.01 30.61,39.42 31.38,38.65 35.26,38.65 35.52,38.39
  pour Top (no thermals): 26.7,43.9 24.95,42.15 26.7,42.15
  pour Top (no thermals): 26.7,19.9 24.95,18.15 26.7,18.15
  pour Top (no thermals): 26.7,67.9 24.95,66.15 26.7,66.15
W+  (via drill 0.3)
  Top 0.203: v23.51,66.24 23.22,65.95 U2.8
  Top 0.508: J3.7 12.2,55.71 12.2,60.2 | D2.C 14.7,62.1 13.1,62.1 12.2,61.2 12.2,60.2 | 12.2,60.2 13.4,61.4
  Bottom 0.203: v23.51,66.24 23.51,64.16 22.61,63.26 v16.71,63.26
  pour Top (no thermals): 16.41,60.86 11.98,60.86 11.98,62.94 13.81,64.76 16.41,64.76 17.11,64.06 17.11,61.56
W-
  Top 0.3: U2.2 19.06,66.45 18.25,67.26 18.25,67.77 17.23,68.79 R2.2
  Top 0.508: R2.2 12.01,68.79 10.6,67.38 10.6,66.9 | J3.8 10.6,66.6 10.6,66.7 | 10.6,66.7 10.6,66.9 | 10.6,66.9 10.8,66.9 | 11.8,67.9 10.8,66.9 | 10.8,66.9 10.6,66.7
  pour Top (no thermals): 17.01,69.46 17.01,67.86 16.61,67.46 10.45,67.46 10.45,67.52 12.39,69.46
  pour Top (no thermals): 18.31,67.06 17.91,67.46 16.51,67.46 16.51,68.96 17.01,69.46 18.41,68.06 18.41,67.06
WC  (via drill 0.3)
  Top 0.203: U2.9 22.82,66.45 23.23,66.86 P1.1 | U5.11 49.57,73.65 50.05,73.65 50.64,74.24 v50.79,74.24
  Bottom 0.203: v50.79,74.24 49.98,74.24 47.71,71.97 41.48,71.97 39.58,73.87 30.54,73.87 27.77,71.1 P1.1

### Text on the board
tPlace: 3,3V | RX | TX | GND | B2 | B1 | B0 | B | M | Tim Billiet | JLCJLCJLCJLC
bPlace: G+ | W- | G- | W+ | R+ | B- | R- | B+